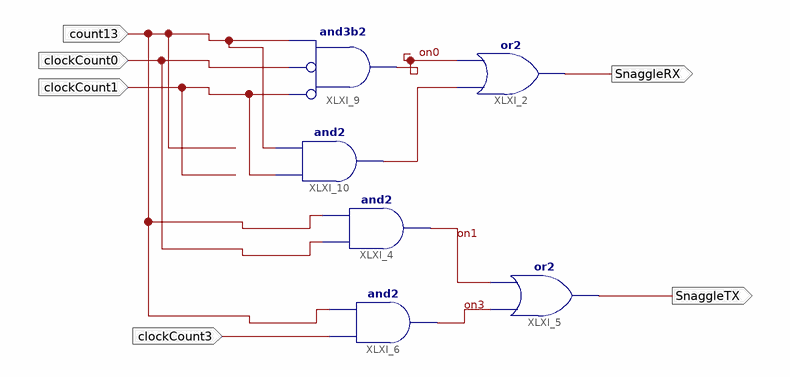
[diagram p0: schematic sheet 1]
// Xilinx ISE schematic SNAGGLE_RX.sch (spartan3e) as structural Verilog: 6 symbols, 6 ports
module SNAGGLE_RX (
  input  clockCount1,
  input  clockCount0,
  input  count13,
  input  clockCount3,
  output SnaggleTX,
  output SnaggleRX
);

  wire on0, on1, on3, XLXN_33;

  or XLXI_2 (SnaggleRX, XLXN_33, on0);
  and XLXI_4 (on1, clockCount0, count13);
  or XLXI_5 (SnaggleTX, on3, on1);
  and XLXI_6 (on3, clockCount3, count13);
  and XLXI_9 (on0, ~clockCount1, ~clockCount0, count13);  // and3b2
  and XLXI_10 (XLXN_33, clockCount1, count13);
endmodule
